# EAGLE design wt11u_breakout_board_v30 (EAGLE 7.5.0)
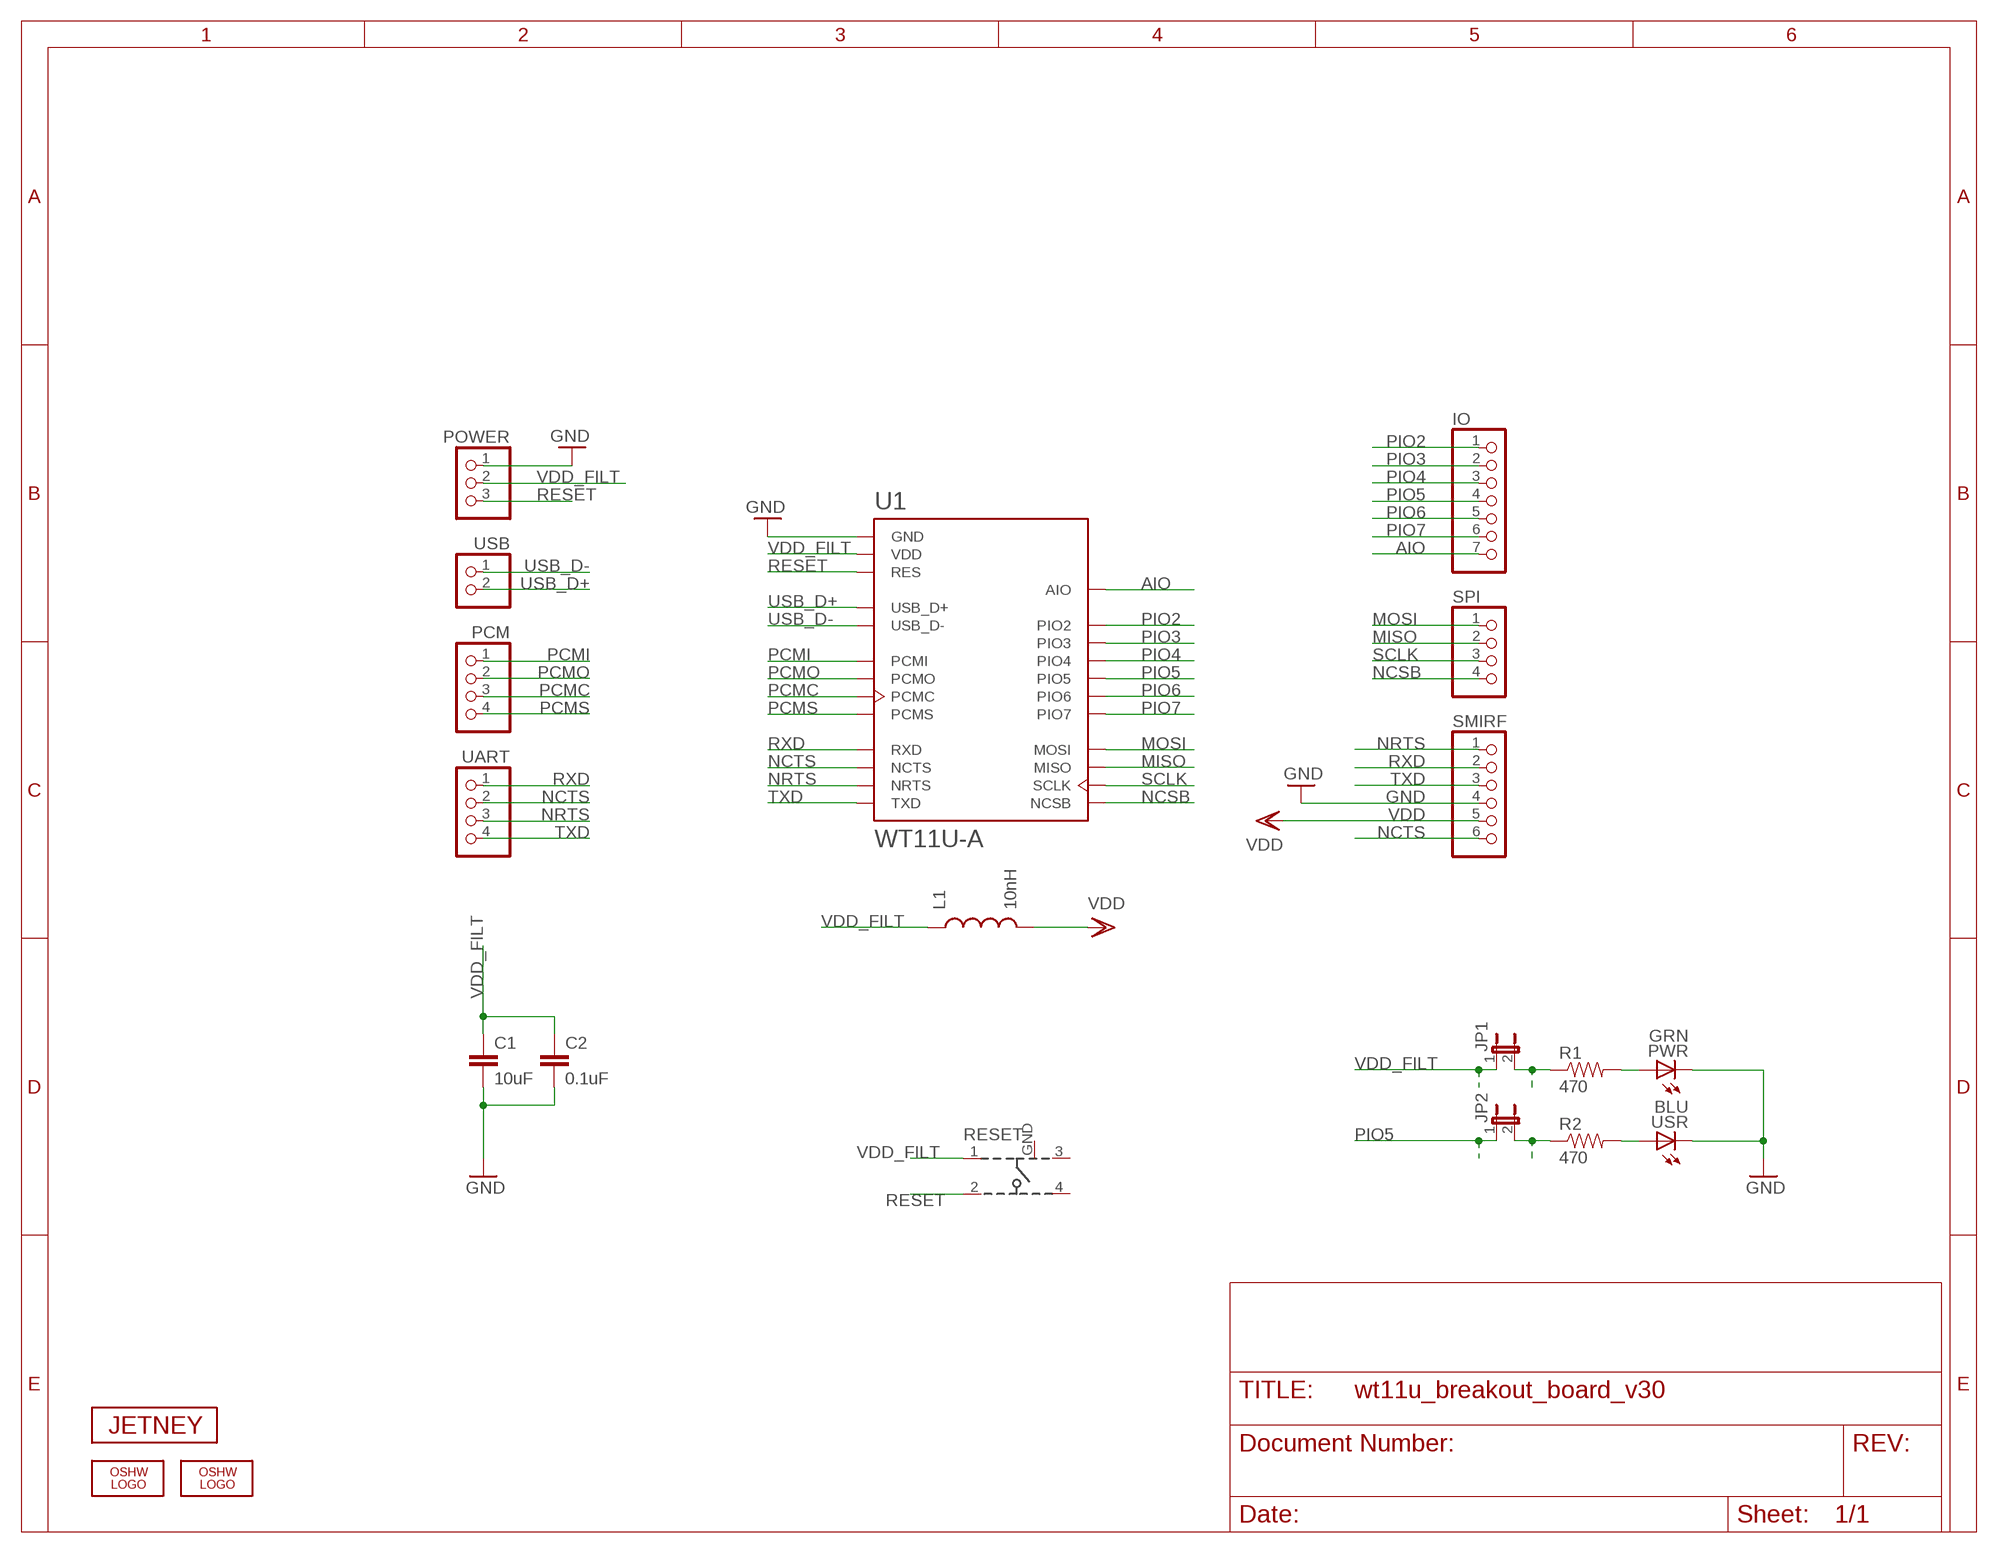
[diagram p0: schematic, sheet 1]

## Parts
C1  10uF  CAP0603-CAP  [0603-CAP]
C2  0.1uF  CAP0603-CAP  [0603-CAP]
IO  PINHD-1X7  [1X07]
JP1  JUMPER-2SMD-NC  [SJ_2S]
JP2  JUMPER-2SMD-NC  [SJ_2S]
L1  10nH  INDUCTOR0603  [0603]
LOGO1  OSHW_LOGO_FILLX0070-NT  [OSHW_FILLX70_NOTEXT]
LOGO3  OSHW_LOGO_FILLX0070-NT  [OSHW_FILLX70_NOTEXT]
PCM  PINHD-1X4  [1X04]
POWER  PINHD-1X3  [1X03]
PWR  GRN  LEDCHIPLED_0805  [CHIPLED_0805]
R1  470  RESISTOR0603-RES  [0603-RES]
R2  470  RESISTOR0603-RES  [0603-RES]
RESET  101-IG  [101-IG]
SMIRF  PINHD-1X6  [1X06]
SPI  PINHD-1X4  [1X04]
U1  WT11U-A  [WT11U-A]
U$2  JETNEY-LOGO-12  [JETNEY-LOGO-12]
UART  PINHD-1X4  [1X04]
USB  PINHD-1X2  [1X02]
USR  BLU  LEDCHIPLED_0805  [CHIPLED_0805]

## Nets
AIO: IO.7 U1.AIO
GND [power]: C1.2 C2.2 POWER.1 PWR.C SMIRF.4 U1.GND U1.GND@2(GND) U1.GND@3(GND) U1.GND@4(GND) USR.C
MISO: SPI.2 U1.MISO
MOSI: SPI.1 U1.MOSI
N$1: PWR.A R1.2
N$3: R2.2 USR.A
N$4: JP2.2 R2.1
NCSB: SPI.4 U1.NCSB
NCTS: SMIRF.6 U1.NCTS UART.2
NRTS: SMIRF.1 U1.NRTS UART.3
PCMC: PCM.3 U1.PCMC
PCMI: PCM.1 U1.PCMI
PCMO: PCM.2 U1.PCMO
PCMS: PCM.4 U1.PCMS
PIO2: IO.1 U1.PIO2
PIO3: IO.2 U1.PIO3
PIO4: IO.3 U1.PIO4
PIO5: IO.4 JP2.1 U1.PIO5
PIO6: IO.5 U1.PIO6
PIO7: IO.6 U1.PIO7
RESET: POWER.3 RESET.2 U1.RES
RXD: SMIRF.2 U1.RXD UART.1
SCLK: SPI.3 U1.SCLK
TXD: SMIRF.3 U1.TXD UART.4
USB_D+: U1.USB_D+ USB.2
USB_D-: U1.USB_D- USB.1
VDD [power]: L1.2 SMIRF.5
VDD_FILT [power]: C1.1 C2.1 JP1.1 L1.1 POWER.2 RESET.1 U1.VDD U1.VDD@2(VDD)
VDDJP1 [power]: JP1.2 R1.1
Unconnected: RESET.3 RESET.4

## Power pins joined to a net without a drawn wire
GND: RESET.GND

## Library data of the parts
C1 C2 = SparkFun:CAP: Capacitor Standard 0603 ceramic capacitor, and 0.1" leaded capacitor.
IO = sf-pinhead:PINHD-1X7: PIN HEADER
JP1 JP2 = SparkFun:JUMPER-2: Jumper Basic 0.1" spaced jumper. Use with breakaway headers.
L1 = SparkFun:INDUCTOR: Inductors Basic Inductor/Choke - 0603 and 1206. Footprints are not proven and vary greatly between part numbers.
LOGO1 LOGO3 = oshw-logo:OSHW_LOGO_FILL
PCM SPI UART = sf-pinhead:PINHD-1X4: PIN HEADER
POWER = sf-pinhead:PINHD-1X3: PIN HEADER
PWR USR = adafruit:LED: LED OSRAM: - CHIPLED LG R971, LG N971, LY N971, LG Q971, LY Q971, LO R971, LY R971 LH N974, LH R974 LS Q976, LO Q976, LY Q976 LO Q996 - Hyper CHIPLED LW Q18S LB Q993, LB Q99A, LB R99A - SideLED LS A670, LO A670, LY A670, LG A670, LP A670 LB A673, LV A673, LT A673, LW A673 LH A674 LY A675 LS A676, LA A676, LO A676, LY A676, LW A676 LS A679, LY A679, LG A679 - Hyper Micro SIDELED® LS Y876, LA Y876, LO Y876, LY Y876 LT Y87S - SmartLED LW L88C, LW L88S LB L89C, LB L89S, LG L890 LS L89K, LO L89K, LY L89K LS L896, LA L896, LO L896, LY L896 - TOPLED LS T670, LO T670, LY T670, LG T670, LP T670 LSG T670, LSP T670, LSY T670, LOP T670, LYG T670 LG T671, LOG T671, LSG T671 LB T673, LV T673, LT T673, LW T673 LH T674 LS T676, LA T676, LO T676, LY T676, LB T676, LH T676, LSB T676, LW T676 LB T67C, LV T67C, LT T67C, LS T67K, LO T67K, LY T67K, LW E67C LS E67B, LA E67B, LO E67B, LY E67B, LB E67C, LV E67C, LT E67C LW T67C LS T679, LY T679, LG T679 LS T770, LO T770, LY T770, LG T770, LP T770 LB T773, LV T773, LT T773, LW T773 LH T774 LS E675, LA E675, LY E675, LS T675 LS T776, LA T776, LO T776, LY T776, LB T776 LHGB T686 LT T68C, LB T68C - Hyper Mini TOPLED® LB M676 - Mini TOPLED Santana® LG M470 LS M47K, LO M47K, LY M47K Source: http://www.osram.convergy.de/
R1 R2 = SparkFun:RESISTOR: Resistor Basic schematic elements and footprints for 0603, 1206, and PTH resistors.
RESET = sf-keyglove:101-IG
SMIRF = sf-pinhead:PINHD-1X6: PIN HEADER
U1 = jetney-silabs-modules:WT11U: Bluegiga WT11i class 1 Bluetooth 2.1 + EDR module. WT11i-A variant has an on-module ceramic chip antenna, WT11i-E variant has a U.Fl connector. WT11i-A variant includes keepout/restrict area. Antenna edge of the module should be flush up against the edge of the PCB. See datasheet for variant layout details. The WT11i is a fully integrated Bluetooth 2.1 + EDR, class 1 module combining antenna, Bluetooth radio, and an on-board iWRAP Bluetooth stack. Bluegiga's WT11i constitutes the ideal solution for developers that want to quickly integrate long-range and high-performance Bluetooth wireless technology into their design without investing several months in Bluetooth radio and stack development. It provides a 100dB link budget ensuring long range and robust Bluetooth connectivity and uses Bluegiga's iWRAP Bluetooth stack, which is an embedded Bluetooth stack implementing 13 different Bluetooth profiles and Apple iAP connectivity. By using WT11i combined with iWRAP Bluetooth stack and Bluegiga's excellent technical support, designers ensure quick time-to-market and low development costs and risks. http://www.bluegiga.com/en-US/products/bluetooth-classic-modules/wt11i-bluetooth-class-1-module https://github.com/jrowberg/sf-oshw Last updated 2014-01-04 by Jeff Rowberg <jeff@rowberg.net>; ANTENNA: On-module ceramic chip antenna
U$2 = sf-keyglove:JETNEY-LOGO
USB = sf-pinhead:PINHD-1X2: PIN HEADER

## Net classes
0 default: width 0.152 mm, drill 0.33 mm, clearance 0.152 mm
1 power: width 0.254 mm, drill 0.33 mm, clearance 0.152 mm

## Board
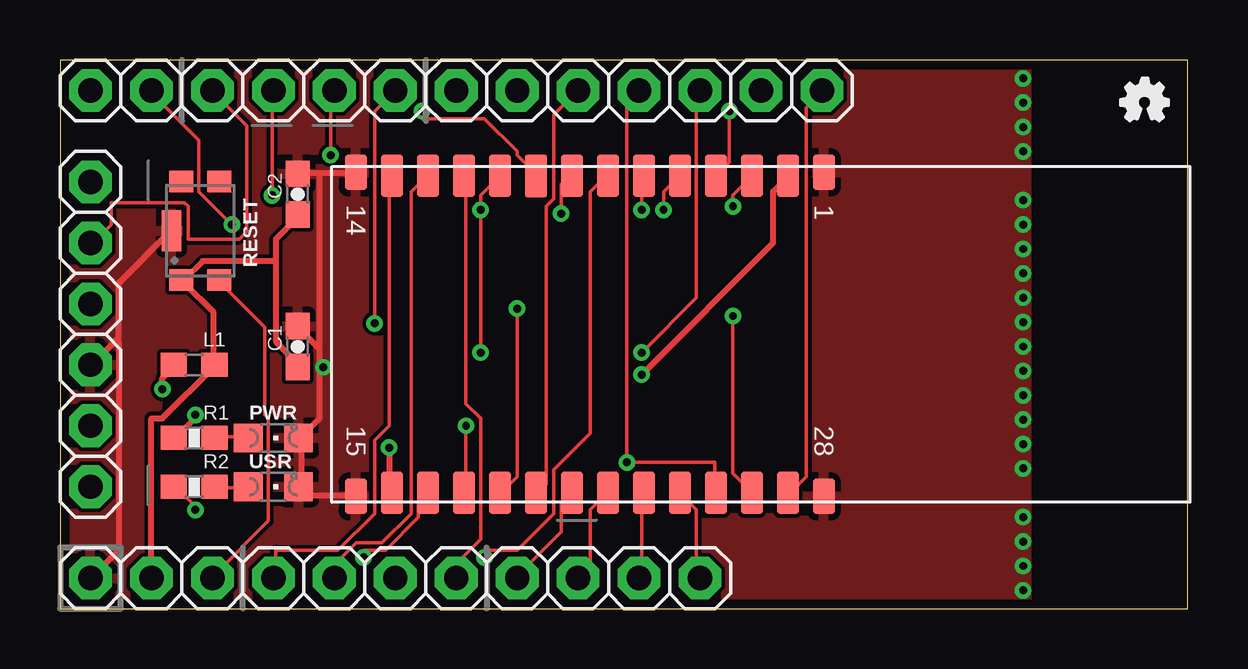
[diagram p1: board, top side]
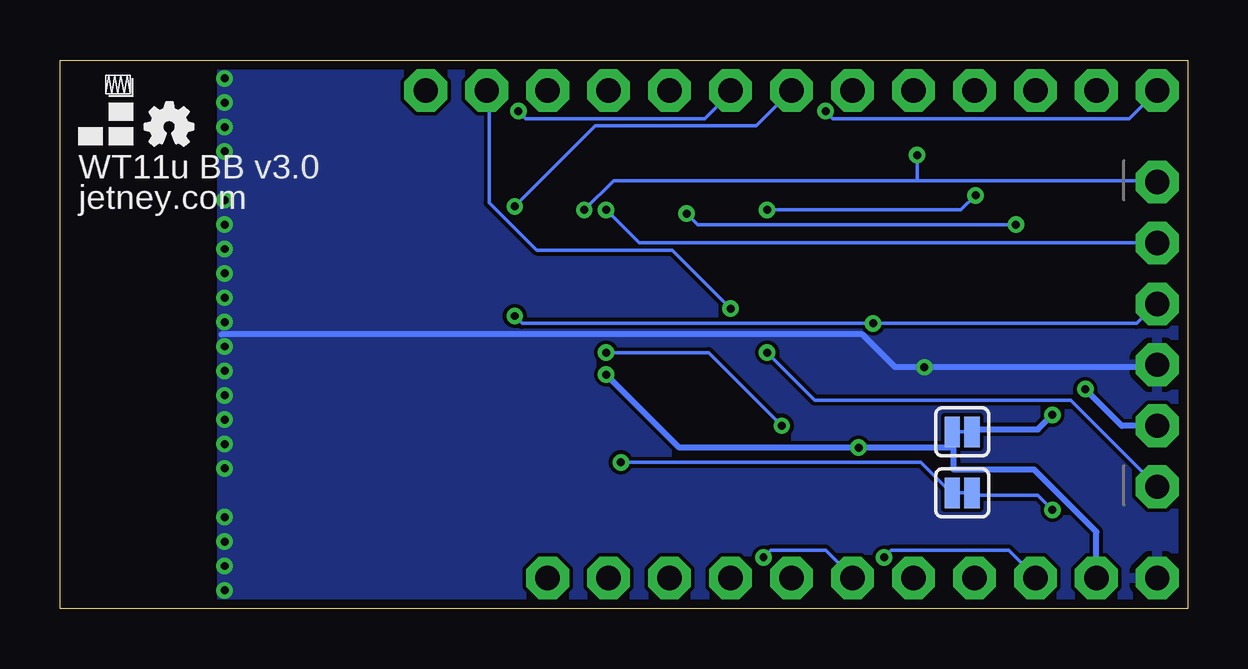
[diagram p2: board, bottom side, seen from below]

Size 46.99 x 22.86 mm. Coordinates in mm from the lower left corner, seen from the top.
Outline: 0,0 46.99,0 46.99,22.86 0,22.86 0,0
Copper layers (1*16): Top 0.0356mm / dielectric 1.5011mm / Bottom 0.0356mm
Design rules "LaenPCBOrder *": minimum track width 6mil, minimum drill 13mil, track to track 6mil, track to pad 6mil, pad to pad 6mil, via to via 6mil, smd to smd 6mil, copper to edge 15mil, drill to drill 6mil, minimum pad ring 7mil, minimum via ring 7mil, stop-mask expansion 4mil, vias tented up to drill 13mil, thermal gap 10mil
vRestrict: area 0,19.3 to 33,20.3; area 0,2.5 to 27.9,3.6; area 2.5,3.8 to 3.8,19.1; area 7.9,5.8 to 9.4,6.3; area 7.9,7.9 to 9.4,8.4

### Footprints (pad centres in the part's own frame; a part is rotated, then mirrored left to right if it is on the bottom)
0603-CAP = smd 1.1 x 1: 1 -0.85,0; 2 0.85,0
1X07 = drill 1.016 pad 1.778 octagon: 1 -7.62,0; 2 -5.08,0; 3 -2.54,0; 4 0,0; 5 2.54,0; 6 5.08,0; 7 7.62,0
SJ_2S = smd 0.635 x 1.27: 1 -0.412,0; 2 0.412,0
0603 = smd 1.1 x 1: 1 -0.85,0; 2 0.85,0
1X04 = drill 1.016 pad 1.778 octagon: 1 -3.81,0; 2 -1.27,0; 3 1.27,0; 4 3.81,0
1X03 = drill 1.016 pad 1.778 octagon: 1 -2.54,0; 2 0,0; 3 2.54,0
CHIPLED_0805 = smd 1.2 x 1.2: A 0,-1.05; C 0,1.05
0603-RES = smd 1.1 x 1: 1 -0.85,0; 2 0.85,0
101-IG = smd 0.9 x 1: 1 -2.05,0.8; 2 -2.05,-0.8; 3 2.05,0.8; 4 2.05,-0.8 | smd 1.7 x 0.8: GND 0,1.2
1X06 = drill 1.016 pad 1.778 octagon: 1 -6.35,0; 2 -3.81,0; 3 -1.27,0; 4 1.27,0; 5 3.81,0; 6 6.35,0
WT11U-A = smd 1.778 x 0.914: AIO 6.6,1.12; MISO 6.6,-4.88; MOSI 6.6,-3.38; NCSB 6.6,-7.88; NCTS -6.6,-10.88; NRTS -6.6,-3.38; PCMC -6.6,-13.88; PCMI -6.6,-12.38; PCMO -6.6,-6.38; PCMS -6.6,-15.38; PIO2 -6.6,-0.38; PIO3 -6.6,-1.88; PIO4 6.6,-9.38; PIO5 6.6,-1.88; PIO6 6.6,-12.38; PIO7 6.6,-10.88; RES 6.6,-13.88; RXD -6.6,-4.88; SCLK 6.6,-6.38; TXD 6.6,-0.38; USB_D+ -6.6,-7.88; USB_D- -6.6,-9.38; VDD -6.6,1.12; VDD@2 6.6,-15.38 | smd 1.478 x 0.914: GND -6.75,2.62; GND@2 -6.75,-16.88; GND@3 6.75,-16.88; GND@4 6.75,2.62
1X02 = drill 1.016 pad 1.778 octagon: 1 -1.27,0; 2 1.27,0

### Placement (x,y rotation side)
C1  9.91,10.92 90 top
C2  9.91,17.27 90 top
IO  24.13,21.59 0 top
JP1  9.4,7.37 0 bottom
JP2  9.4,4.83 0 bottom
L1  5.59,10.16 180 top
LOGO1  44.2,20.32 0 top
LOGO3  43.43,19.3 0 bottom
PCM  12.7,1.27 180 top
POWER  3.81,1.27 0 top
PWR  8.89,7.11 270 top
R1  5.59,7.11 0 top
R2  5.59,5.08 0 top
RESET  5.84,15.75 90 top
SMIRF  1.27,11.43 270 top
SPI  22.86,1.27 180 top
U1  29.21,11.43 270 top
U$2  46.23,19.3 0 bottom
UART  10.16,21.59 0 top
USB  2.54,21.59 0 top
USR  8.89,5.08 270 top

### Tracks (layer width: path | path; a pad name or v marks a point on that pad's centre or on a via)
AIO
  Top 0.152: IO.7 31.7,21.49 31.09,20.88 31.09,5.49 30.48,4.88 30.4,4.88 U1.AIO
GND  (via drill 0.33)
  Top 0.254: v40.13,0.76 40.26,0.76 | 40.26,11.89 40.18,11.89 v40.13,11.94 | v40.13,1.78 40.18,1.83 40.26,1.83 | v40.13,2.79 40.18,2.74 40.26,2.74 | v40.13,3.81 40.26,3.81 | v40.13,5.84 40.18,5.79 40.26,5.79 | v40.13,6.86 40.26,6.86 | v40.13,7.87 40.18,7.92 40.26,7.92 | v40.13,8.89 40.18,8.84 40.26,8.84 | v40.13,9.91 40.26,9.91 | v40.13,10.92 40.18,10.97 40.26,10.97 | v40.13,12.95 40.26,12.95 | v40.13,13.97 40.18,14.02 40.26,14.02 | v40.13,14.99 40.18,14.94 40.26,14.94 | v40.13,16 40.26,16 | v40.13,17.02 40.18,17.07 40.26,17.07 | v40.13,19.05 40.26,19.05 | v40.13,20.07 40.18,20.12 40.26,20.12 | v40.13,21.08 40.18,21.03 40.26,21.03 | 12.19,18.14 10.82,18.14 | 10.82,18.14 9.91,18.14 C2.2 | 10.74,10.9 10.82,10.82 10.82,10.06 | 10.74,10.9 9.91,11.73 C1.2 | 10.82,10.06 10.82,7.92 10.06,7.16 PWR.C 10.06,7.01 10.06,5.18 USR.C 10.06,5.03 10.06,4.72 12.19,4.72 | 10.82,18.14 10.82,10.97 10.74,10.9 | 2.36,11.2 1.37,10.21 SMIRF.4 | 2.36,11.2 2.44,11.28 2.44,13.56 4.57,15.7 RESET.GND | POWER.1 2.44,2.44 2.44,11.12 2.36,11.2 | v10.97,10.06 10.82,10.06
  Bottom 0.254: SMIRF.4 1.37,10.06 v10.97,10.06 12.19,10.06 13.56,11.43 40.26,11.43
  other vias: 40.13,22.1
  pour Top: 0,22.86 40.26,22.86 40.26,0 0,0
  pour Bottom: 0,22.86 40.26,22.86 40.26,0 0,0
MISO
  Top 0.152: SPI.2 24.23,1.37 24.23,4.72 24.31,4.8 U1.MISO
MOSI
  Top 0.152: SPI.1 26.67,1.37 26.52,1.52 26.52,4.12 25.83,4.8 U1.MOSI
N$1
  Top 0.152: R1.2 6.55,7.16 7.77,7.16 PWR.A
N$3
  Top 0.152: R2.2 6.55,5.03 7.77,5.03 USR.A
N$4  (via drill 0.33)
  Top 0.152: v5.64,4.12 5.64,4.27 4.88,5.03 R2.1
  Bottom 0.152: v5.64,4.12 6.25,4.72 8.84,4.72 JP2.2
N$5
  Bottom 0.152: 9.14,4.83 9.65,4.83
N$6
  Bottom 0.152: 9.14,7.37 9.65,7.37
NCSB
  Top 0.152: SPI.4 19.05,1.37 20.88,3.2 20.88,4.42 21.26,4.8 U1.NCSB
NCTS  (via drill 0.33)
  Top 0.152: v17.53,10.67 v17.53,16.61 17.53,17.22 18.29,17.98 U1.NCTS | v8.84,17.22 8.84,21.49 UART.2
  Bottom 0.152: v17.53,10.67 15.54,8.69 4.88,8.69 SMIRF.6 | v8.84,17.22 9.45,16.61 v17.53,16.61
NRTS  (via drill 0.33)
  Top 0.152: v25.15,16.61 25.15,17.37 25.76,17.98 U1.NRTS | v11.28,18.9 11.28,21.34 11.43,21.49 UART.3
  Bottom 0.152: v25.15,16.61 23.93,17.83 11.28,17.83 | 11.28,17.83 1.37,17.83 SMIRF.1 | 11.28,17.83 v11.28,18.9
PCMC
  Top 0.152: PCM.3 11.43,1.83 12.34,2.74 13.41,2.74 14.63,3.96 14.63,17.37 15.24,17.98 15.32,17.98 U1.PCMC
PCMI
  Top 0.152: PCM.1 16.61,1.37 16.61,1.98 17.53,2.9 17.53,7.92 16.92,8.53 16.92,17.98 16.84,17.98 U1.PCMI
PCMO  (via drill 0.33)
  Top 0.152: v17.68,2.13 17.68,2.44 19.05,2.44 20.57,3.96 20.57,5.79 22.1,7.32 22.1,17.37 22.71,17.98 22.78,17.98 U1.PCMO
  Bottom 0.152: v17.68,2.13 17.37,2.44 15.09,2.44 14.02,1.37 PCM.2
PCMS
  Top 0.152: PCM.4 8.99,1.37 8.99,2.44 11.58,2.44 13.11,3.96 13.11,7.01 13.72,7.62 13.72,17.98 13.79,17.98 U1.PCMS
PIO2  (via drill 0.33)
  Top 0.152: v28.04,16.76 28.04,17.22 28.8,17.98 U1.PIO2
  Bottom 0.152: v28.04,16.76 24.69,20.12 17.98,20.12 IO.1
PIO3  (via drill 0.33)
  Top 0.152: v27.89,20.73 27.89,18.59 27.36,18.06 U1.PIO3
  Bottom 0.152: v27.89,20.73 27.58,20.42 20.12,20.42 19.05,21.49 IO.2
PIO4
  Top 0.152: IO.3 20.57,20.57 20.57,17.07 20.27,16.76 20.27,5.18 19.96,4.88 19.89,4.88 U1.PIO4
PIO5  (via drill 0.33)
  Top 0.152: IO.4 24.08,21.49 23.62,21.03 v23.62,6.1 27.28,6.1 27.28,4.88 U1.PIO5
  Bottom 0.152: v23.62,6.1 11.12,6.1 9.91,4.88 JP2.1
PIO6  (via drill 0.33)
  Top 0.152: v16.92,7.62 16.92,4.88 16.84,4.88 U1.PIO6 | v24.23,10.67 26.52,12.95 26.52,21.34 26.67,21.49 IO.5
  Bottom 0.152: v16.92,7.62 19.96,10.67 v24.23,10.67
PIO7  (via drill 0.33)
  Top 0.152: v19.05,12.5 19.05,5.49 18.44,4.88 18.36,4.88 U1.PIO7
  Bottom 0.152: v19.05,12.5 21.49,14.94 27.13,14.94 29.11,16.92 29.11,21.49 IO.6
RESET  (via drill 0.33)
  Top 0.152: RESET.2 6.71,13.56 8.53,11.73 8.53,8.08 8.69,7.92 8.69,3.66 6.4,1.37 POWER.3 | v12.65,2.13 12.65,2.44 13.56,2.44 14.94,3.81 14.94,4.42 15.32,4.8 U1.RES
  Bottom 0.152: v12.65,2.13 12.34,2.44 7.47,2.44 6.4,1.37 POWER.3
RXD  (via drill 0.33)
  Top 0.152: v24.23,16.61 24.23,17.98 24.31,17.98 U1.RXD | UART.1 6.4,21.49 7.77,20.12 7.77,15.7 7.47,15.39 5.33,15.39 5.33,16.76 5.18,16.92 2.13,16.92 2.13,16 1.37,15.24 SMIRF.2
  Bottom 0.152: v24.23,16.61 22.86,15.24 SMIRF.2
SCLK
  Top 0.152: SPI.3 21.64,1.37 22.1,1.83 22.1,4.12 22.78,4.8 U1.SCLK
TXD  (via drill 0.33)
  Top 0.152: v28.04,12.19 28.04,5.64 28.8,4.88 U1.TXD | UART.4 13.11,20.73 v13.11,11.89
  Bottom 0.152: v28.04,12.19 27.74,11.89 v13.11,11.89 2.13,11.89 1.37,12.65 SMIRF.3
USB_D+  (via drill 0.33)
  Top 0.152: v20.88,16.46 20.88,17.68 21.18,17.98 21.26,17.98 U1.USB_D+ | v7.16,16 5.79,17.37 5.79,19.51 3.81,21.49 USB.2
  Bottom 0.152: v20.88,16.46 20.42,16 v7.16,16
USB_D-  (via drill 0.33)
  Top 0.152: v15.09,20.73 15.09,20.42 17.68,20.42 19.05,19.05 19.05,18.9 19.81,18.14 19.81,18.06 U1.USB_D-
  Bottom 0.152: v15.09,20.73 14.78,20.42 2.44,20.42 USB.1
VDD  (via drill 0.33)
  Top 0.254: v4.27,9.14 4.27,9.6 4.72,10.06 L1.2
  Bottom 0.254: v4.27,9.14 2.74,7.62 SMIRF.5
VDD_FILT  (via drill 0.33)
  Top 0.254: 8.99,14.48 8.99,15.39 9.91,16.31 C2.1 | 8.99,14.48 8.99,11.12 9.91,10.21 C1.1 | 8.99,14.48 5.94,14.48 5.18,13.72 RESET.1 5.18,13.56 6.4,12.34 6.4,10.21 L1.1 6.4,10.06 4.27,7.92 3.81,7.92 POWER.2 | v13.72,6.71 13.72,4.88 13.79,4.88 U1.VDD@2 | v24.23,9.75 29.72,15.24 29.72,17.37 30.33,17.98 U1.VDD
  Bottom 0.254: 9.75,6.71 9.75,5.79 6.4,5.79 3.81,3.2 POWER.2 | 9.75,6.71 9.75,7.32 JP1.1 | 9.75,6.71 v13.72,6.71 21.18,6.71 v24.23,9.75
VDDJP1  (via drill 0.33)
  Top 0.254: v5.64,8.08 5.64,7.92 4.88,7.16 R1.1
  Bottom 0.254: v5.64,8.08 6.25,7.47 8.84,7.47 JP1.2

### Text on the board
bPlace: WT11u BB v3.0 | jetney.com
tDocu: D- D+ | RTS RXD TXD GND 3V3 CTS | RXD CTS RTS TXD | P2 P3 P4 P5 P6 P7 | AIO | Bluegiga / WT11u-A | GND 3V3 RES SYN CLK OUT CSB SCK | IN | MISO | MOSI
bDocu: RTS RXD TXD GND 3V3 CTS | PWR | PIO5